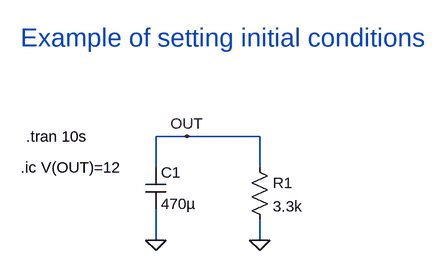
[diagram p0: schematic SetInitialConditions.asc]
SetInitialConditions.asc, the LTspice schematic file:
Version 4.1
SHEET 1 880 680
WIRE 160 64 112 64
WIRE 272 64 160 64
WIRE 112 112 112 64
WIRE 272 112 272 64
WIRE 112 224 112 176
WIRE 272 224 272 192
FLAG 272 224 0
FLAG 112 224 0
FLAG 160 64 OUT
SYMBOL cap 96 112 R0
SYMATTR InstName C1
SYMATTR Value 470µ
SYMBOL res 256 96 R0
SYMATTR InstName R1
SYMATTR Value 3.3k
TEXT -96 112 Left 2 !.ic V(OUT)=12
TEXT -88 64 Left 2 !.tran 10s
TEXT -96 -88 Left 4 ;Example of setting initial conditions

The netlist it stands for:
* SetInitialConditions.asc
C1 OUT 0 470µ
R1 OUT 0 3.3k
.ic V(OUT)=12
.tran 10s
* Example of setting initial conditions
.backanno
.end

* Results of the author's LTspice run, read from the files saved beside the schematic
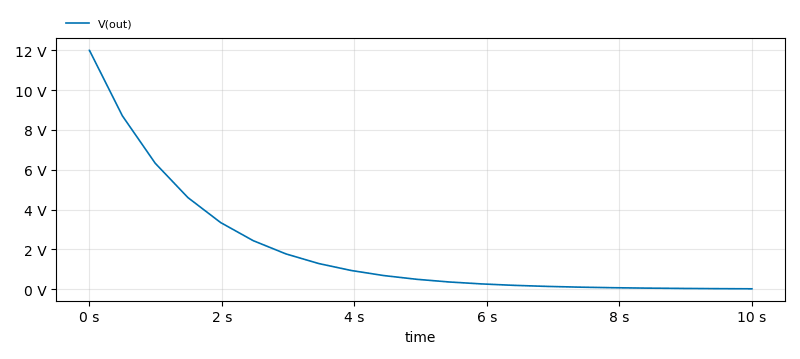
[diagram p1: Transient Analysis of SetInitialConditions.asc, plotted from the saved traces]
* Transient Analysis, 1 run:
*   V(out): min 19.01 mV, max 12 V, average 1.874 V, rms 3.398 V, last 19.01 mV